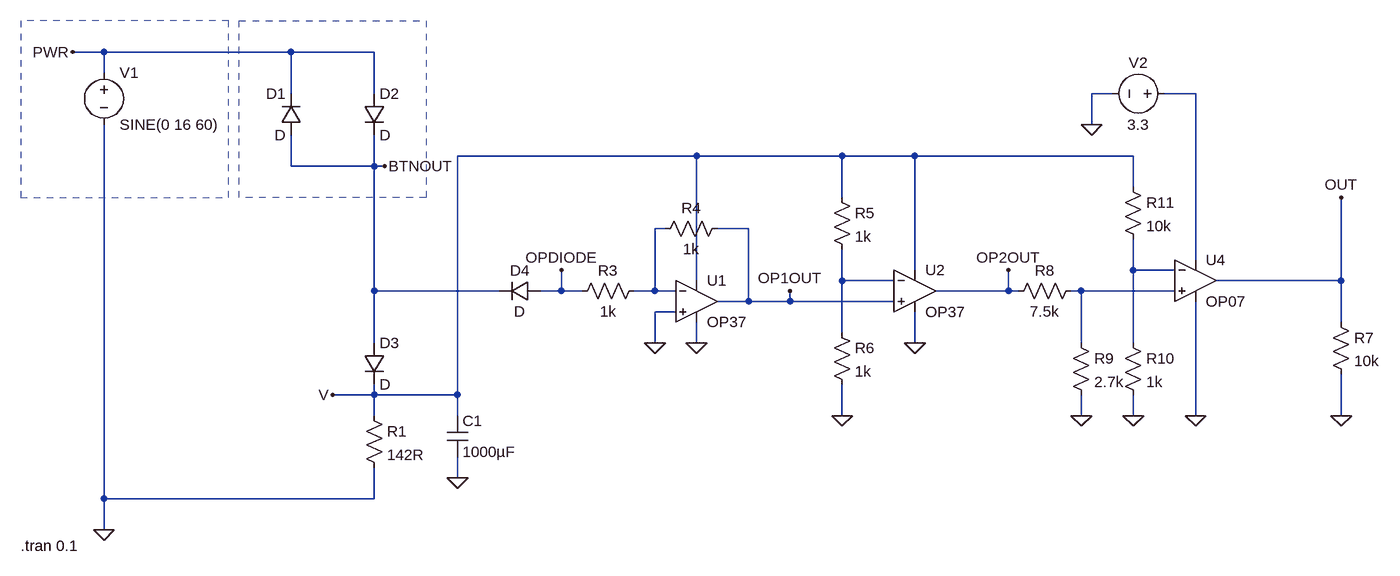
[diagram p0: schematic button-power.asc]
button-power.asc, the LTspice schematic file:
Version 4
SHEET 1 2264 856
WIRE 64 80 16 80
WIRE 352 80 64 80
WIRE 480 80 352 80
WIRE 64 112 64 80
WIRE 352 144 352 80
WIRE 480 144 480 80
WIRE 1616 144 1584 144
WIRE 1744 144 1696 144
WIRE 1584 192 1584 144
WIRE 976 240 608 240
WIRE 1200 240 976 240
WIRE 1312 240 1200 240
WIRE 1648 240 1312 240
WIRE 352 256 352 208
WIRE 480 256 480 208
WIRE 480 256 352 256
WIRE 496 256 480 256
WIRE 1648 288 1648 240
WIRE 1200 304 1200 240
WIRE 928 352 912 352
WIRE 1056 352 1008 352
WIRE 1744 400 1744 144
WIRE 1312 416 1312 240
WIRE 1648 416 1648 368
WIRE 1712 416 1648 416
WIRE 976 432 976 240
WIRE 1200 432 1200 384
WIRE 1280 432 1200 432
WIRE 1968 432 1968 304
WIRE 1968 432 1776 432
WIRE 480 448 480 256
WIRE 672 448 480 448
WIRE 768 448 768 416
WIRE 768 448 736 448
WIRE 800 448 768 448
WIRE 912 448 912 352
WIRE 912 448 880 448
WIRE 944 448 912 448
WIRE 1456 448 1456 416
WIRE 1456 448 1344 448
WIRE 1472 448 1456 448
WIRE 1568 448 1552 448
WIRE 1712 448 1568 448
WIRE 1056 464 1056 352
WIRE 1056 464 1008 464
WIRE 1120 464 1120 448
WIRE 1120 464 1056 464
WIRE 1280 464 1120 464
WIRE 944 480 912 480
WIRE 1968 496 1968 432
WIRE 1200 512 1200 432
WIRE 480 528 480 448
WIRE 912 528 912 480
WIRE 976 528 976 496
WIRE 1312 528 1312 480
WIRE 1568 528 1568 448
WIRE 1648 528 1648 416
WIRE 480 608 480 592
WIRE 480 608 416 608
WIRE 608 608 608 240
WIRE 608 608 480 608
WIRE 480 640 480 608
WIRE 608 640 608 608
WIRE 1200 640 1200 592
WIRE 1568 640 1568 608
WIRE 1648 640 1648 608
WIRE 1744 640 1744 464
WIRE 1968 640 1968 576
WIRE 608 736 608 704
WIRE 64 768 64 192
WIRE 480 768 480 720
WIRE 480 768 64 768
WIRE 64 816 64 768
FLAG 16 80 PWR
FLAG 64 816 0
FLAG 608 736 0
FLAG 416 608 V
FLAG 496 256 BTNOUT
FLAG 912 528 0
FLAG 976 528 0
FLAG 1120 448 OP1OUT
FLAG 1312 528 0
FLAG 1200 640 0
FLAG 1456 416 OP2OUT
FLAG 768 416 OPDIODE
FLAG 1744 640 0
FLAG 1584 192 0
FLAG 1968 640 0
FLAG 1968 304 OUT
FLAG 1568 640 0
FLAG 1648 640 0
SYMBOL voltage 64 96 R0
WINDOW 123 0 0 Left 2
WINDOW 39 0 0 Left 2
SYMATTR InstName V1
SYMATTR Value SINE(0 16 60)
SYMBOL diode 368 208 R180
WINDOW 0 24 64 Left 2
WINDOW 3 24 0 Left 2
SYMATTR InstName D1
SYMBOL diode 464 144 R0
SYMATTR InstName D2
SYMBOL diode 464 528 R0
SYMATTR InstName D3
SYMBOL res 464 624 R0
SYMATTR InstName R1
SYMATTR Value 142R
SYMBOL cap 592 640 R0
SYMATTR InstName C1
SYMATTR Value 1000µF
SYMBOL Opamps\\OP37 976 400 R0
SYMATTR InstName U1
SYMBOL res 896 432 R90
WINDOW 0 0 56 VBottom 2
WINDOW 3 32 56 VTop 2
SYMATTR InstName R3
SYMATTR Value 1k
SYMBOL res 1024 336 R90
WINDOW 0 0 56 VBottom 2
WINDOW 3 32 56 VTop 2
SYMATTR InstName R4
SYMATTR Value 1k
SYMBOL diode 736 432 R90
WINDOW 0 0 32 VBottom 2
WINDOW 3 32 32 VTop 2
SYMATTR InstName D4
SYMBOL Opamps\\OP37 1312 384 R0
SYMATTR InstName U2
SYMBOL res 1184 288 R0
SYMATTR InstName R5
SYMATTR Value 1k
SYMBOL res 1184 496 R0
SYMATTR InstName R6
SYMATTR Value 1k
SYMBOL voltage 1712 144 R90
WINDOW 0 -32 56 VBottom 2
WINDOW 3 32 56 VTop 2
WINDOW 123 0 0 Left 2
WINDOW 39 0 0 Left 2
SYMATTR InstName V2
SYMATTR Value 3.3
SYMBOL res 1952 480 R0
SYMATTR InstName R7
SYMATTR Value 10k
SYMBOL res 1568 432 R90
WINDOW 0 0 56 VBottom 2
WINDOW 3 32 56 VTop 2
SYMATTR InstName R8
SYMATTR Value 7.5k
SYMBOL res 1552 512 R0
SYMATTR InstName R9
SYMATTR Value 2.7k
SYMBOL res 1632 512 R0
SYMATTR InstName R10
SYMATTR Value 1k
SYMBOL res 1632 272 R0
SYMATTR InstName R11
SYMATTR Value 10k
SYMBOL Opamps\\OP07 1744 368 R0
SYMATTR InstName U4
TEXT -64 840 Left 2 !.tran 0.1
RECTANGLE Normal 560 304 272 32 2
RECTANGLE Normal -64 304 256 32 2

The netlist it stands for:
* button-power.asc
V1 PWR 0 SINE(0 16 60)
D1 BTNOUT PWR D
D2 PWR BTNOUT D
D3 BTNOUT V D
R1 V 0 142R
C1 V 0 1000µF
XU1 0 N002 V 0 OP1OUT LT1037  ; OP37, pins In+ In- V+ V- OUT
R3 N002 OPDIODE 1k
R4 OP1OUT N002 1k
D4 OPDIODE BTNOUT D
XU2 OP1OUT N004 V 0 OP2OUT LT1037  ; OP37, pins In+ In- V+ V- OUT
R5 V N004 1k
R6 N004 0 1k
V2 N001 0 3.3
R7 OUT 0 10k
R8 N005 OP2OUT 7.5k
R9 N005 0 2.7k
R10 N003 0 1k
R11 V N003 10k
XU4 N005 N003 N001 0 OUT LT1001  ; OP07, pins In+ In- V+ V- OUT
.model D D
.lib standard.dio
.tran 0.1
.lib LTC.lib
.backanno
.end